# Altium schematic sheet sensor.SchDoc
size A3
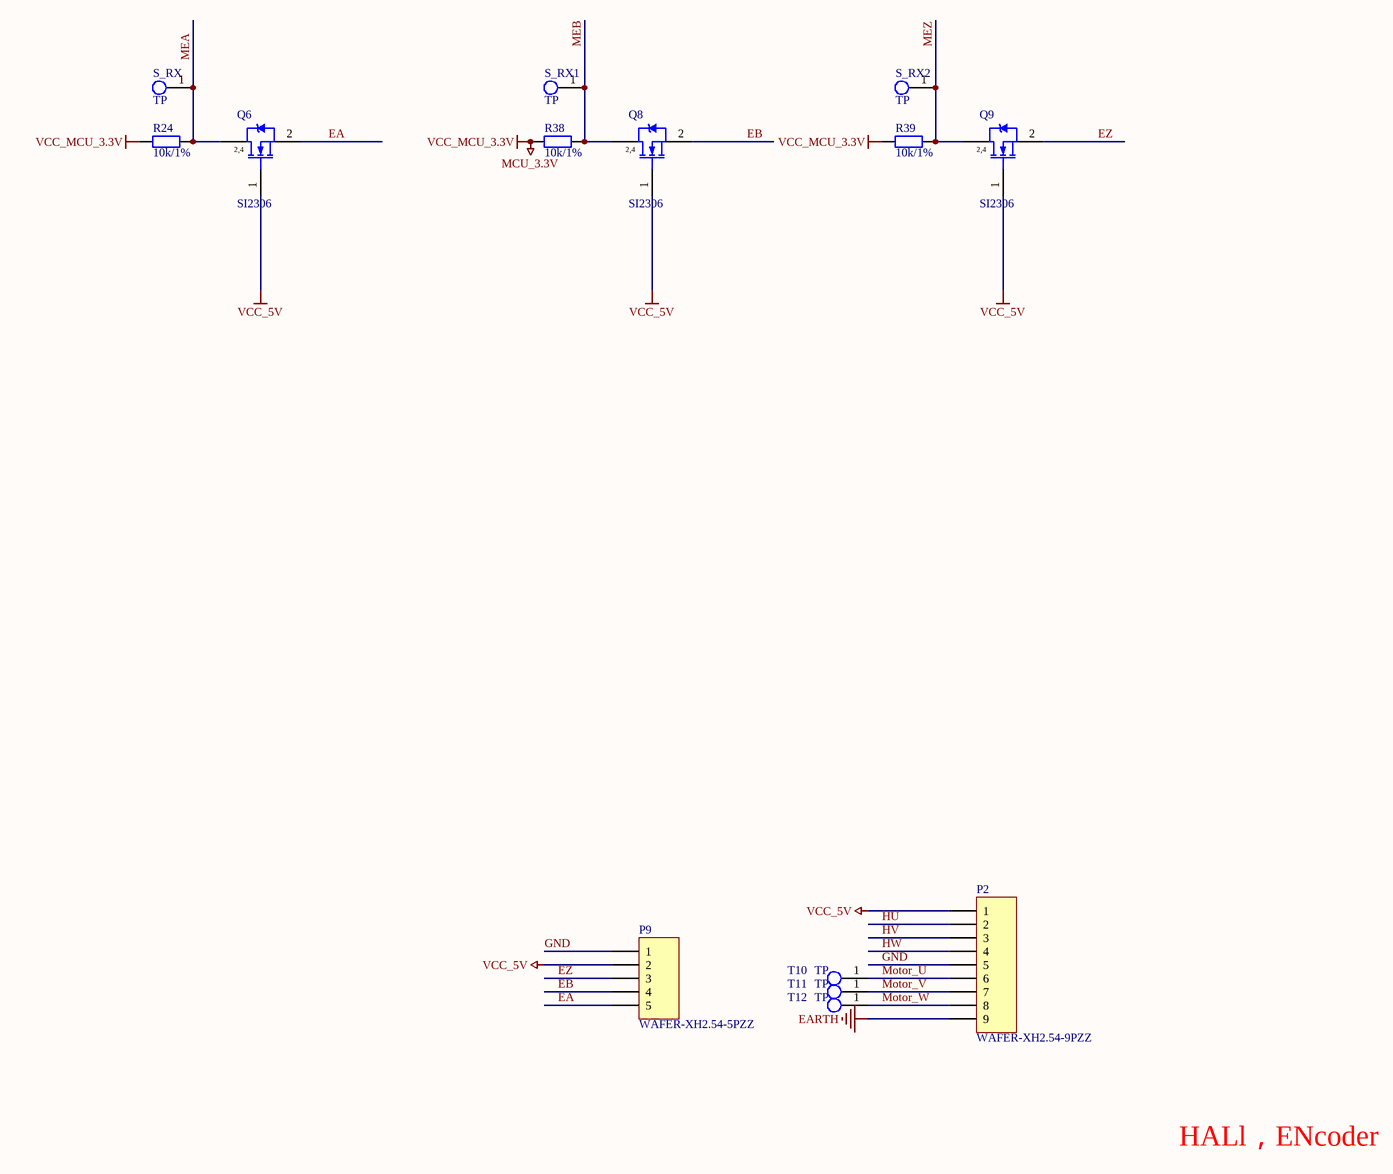
[diagram p0: sensor.SchDoc]

## Parts
P2  WAFER-XH2.54-9PZZ  [XA2.5-9P]
P9  WAFER-XH2.54-5PZZ  [XA2.5-5P]
Q6  SI2306  [SOT23-3]
Q8  SI2306  [SOT23-3]
Q9  SI2306  [SOT23-3]
R24  10k/1%  [0603R]
R38  10k/1%  [0603R]
R39  10k/1%  [0603R]
S_RX  TP  [TPD]
S_RX1  TP  [TPD]
S_RX2  TP  [TPD]
T10  TP  [TPD]
T11  TP  [TPD]
T12  TP  [TPD]

## Nets
EARTH: P2.9
MCU_3.3V: R24.1 R38.1 R39.1  [also labelled VCC_MCU_3.3V]
VCC_5V: P2.1 P9.2 Q6.1(G) Q8.1(G) Q9.1(G)
EA: P9.5 Q6.2(S)
EB: P9.4 Q8.2(S)
EZ: P9.3 Q9.2(S)
GND: P2.5 P9.1
HU: P2.2
HV: P2.3
HW: P2.4
MEA: Q6.3(D) R24.2 S_RX.1
MEB: Q8.3(D) R38.2 S_RX1.1
MEZ: Q9.3(D) R39.2 S_RX2.1
Motor_U: P2.6 T10.1
Motor_V: P2.7 T11.1
Motor_W: P2.8 T12.1

## Notes on the sheet
- HALl，ENcoder
- (in symbol BUK92150-55A) 2,4

## Library data of the parts
P2 = Header 9: Header, 9-Pin; Package: XA2.5-9P
P9 = Header 5: Header, 5-Pin; Package: XA2.5-5P
Q6 Q8 Q9 = BUK92150-55A: Package: SOT23-3
R24 R38 R39 = Res2: Resistor; Package: 0603
S_RX S_RX1 S_RX2 T10-T12 = TP: Package: TPD